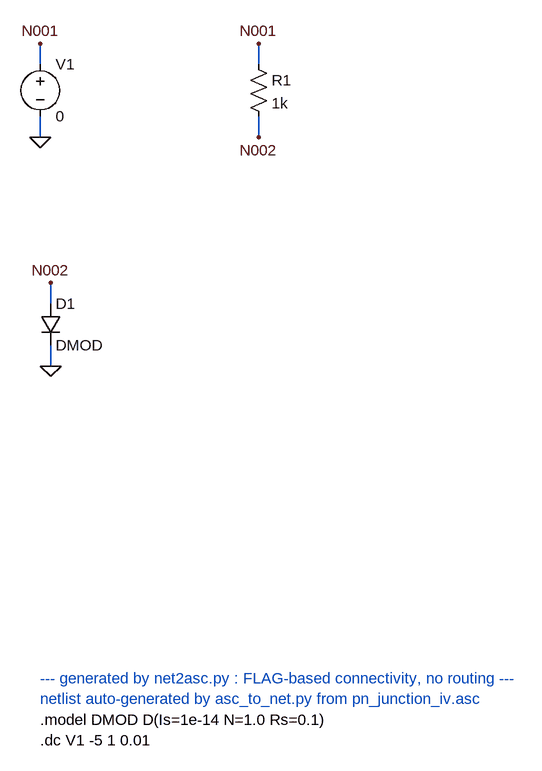
[diagram p0: schematic pn_junction_iv.asc]
pn_junction_iv.asc, the LTspice schematic file:
Version 4
SHEET 1 880 1256
WIRE 0 16 0 -16
WIRE 0 96 0 128
WIRE 336 16 336 -16
WIRE 336 96 336 128
WIRE 16 384 16 352
WIRE 16 448 16 480
FLAG 0 -16 N001
FLAG 0 128 0
FLAG 336 -16 N001
FLAG 336 128 N002
FLAG 16 352 N002
FLAG 16 480 0
SYMBOL voltage 0 0 R0
SYMATTR InstName V1
SYMATTR Value 0
SYMBOL res 320 0 R0
SYMATTR InstName R1
SYMATTR Value 1k
SYMBOL diode 0 384 R0
SYMATTR InstName D1
SYMATTR Value DMOD
TEXT 0 960 Left 2 ;--- generated by net2asc.py : FLAG-based connectivity, no routing ---
TEXT 0 992 Left 2 ;netlist auto-generated by asc_to_net.py from pn_junction_iv.asc
TEXT 0 1024 Left 2 !.model DMOD D(Is=1e-14 N=1.0 Rs=0.1)
TEXT 0 1056 Left 2 !.dc V1 -5 1 0.01

The netlist it stands for:
* pn_junction_iv.asc
V1 N001 0 0
R1 N001 N002 1k
D1 N002 0 DMOD
.model D D
.lib standard.dio
* --- generated by net2asc.py : FLAG-based connectivity, no routing ---
* netlist auto-generated by asc_to_net.py from pn_junction_iv.asc
.model DMOD D(Is=1e-14 N=1.0 Rs=0.1)
.dc V1 -5 1 0.01
.backanno
.end